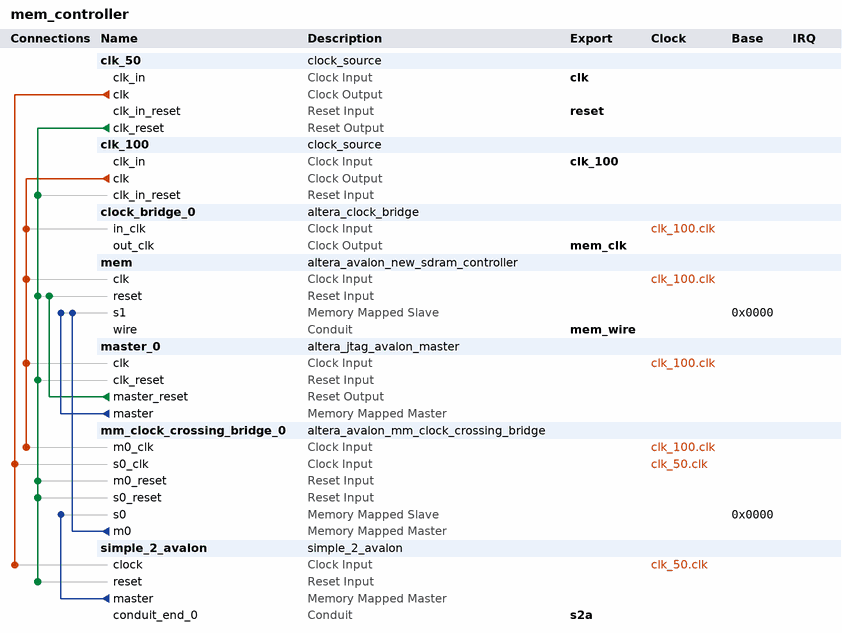
[diagram p0: system contents]
# Platform Designer (Qsys) system mem_controller, Cyclone IV E EP4CE6E22C8
# Parameters at their usual value, and those the tool derives, are not listed.
package require -exact qsys 14.0
create_system mem_controller
set_project_property DEVICE_FAMILY {Cyclone IV E}
set_project_property DEVICE EP4CE6E22C8

add_instance clk_50 clock_source 14.0
set_instance_parameter_value clk_50 clockFrequency 50000000

add_instance clk_100 clock_source 14.0
set_instance_parameter_value clk_100 clockFrequency 100000000

add_instance clock_bridge_0 altera_clock_bridge 14.0
set_instance_parameter_value clock_bridge_0 DERIVED_CLOCK_RATE 100000000
set_instance_parameter_value clock_bridge_0 EXPLICIT_CLOCK_RATE 0

add_instance mem altera_avalon_new_sdram_controller 14.0
set_instance_parameter_value mem TAC 5.5
set_instance_parameter_value mem TRCD 15.0
set_instance_parameter_value mem TRP 20.0
set_instance_parameter_value mem TWR 7.0
set_instance_parameter_value mem casLatency 3
set_instance_parameter_value mem columnWidth 8
set_instance_parameter_value mem dataWidth 16
set_instance_parameter_value mem generateSimulationModel true
set_instance_parameter_value mem model single_Micron_MT48LC4M32B2_7_chip
set_instance_parameter_value mem numberOfBanks 2
set_instance_parameter_value mem numberOfChipSelects 1
set_instance_parameter_value mem powerUpDelay 200.0
set_instance_parameter_value mem refreshPeriod 15.625
set_instance_parameter_value mem rowWidth 11

add_instance master_0 altera_jtag_avalon_master 14.0

add_instance mm_clock_crossing_bridge_0 altera_avalon_mm_clock_crossing_bridge 14.0
set_instance_parameter_value mm_clock_crossing_bridge_0 DATA_WIDTH 32
set_instance_parameter_value mm_clock_crossing_bridge_0 ADDRESS_WIDTH 19
set_instance_parameter_value mm_clock_crossing_bridge_0 USE_AUTO_ADDRESS_WIDTH 0
set_instance_parameter_value mm_clock_crossing_bridge_0 ADDRESS_UNITS WORDS
set_instance_parameter_value mm_clock_crossing_bridge_0 MAX_BURST_SIZE 1
set_instance_parameter_value mm_clock_crossing_bridge_0 COMMAND_FIFO_DEPTH 4
set_instance_parameter_value mm_clock_crossing_bridge_0 RESPONSE_FIFO_DEPTH 4
set_instance_parameter_value mm_clock_crossing_bridge_0 MASTER_SYNC_DEPTH 2
set_instance_parameter_value mm_clock_crossing_bridge_0 SLAVE_SYNC_DEPTH 2

add_instance simple_2_avalon simple_2_avalon 1.0
set_instance_parameter_value simple_2_avalon ADDR_W 21

# connections
add_connection clk_50.clk mm_clock_crossing_bridge_0.s0_clk clock
add_connection clk_50.clk simple_2_avalon.clock clock
add_connection clk_100.clk clock_bridge_0.in_clk clock
add_connection clk_100.clk master_0.clk clock
add_connection clk_100.clk mem.clk clock
add_connection clk_100.clk mm_clock_crossing_bridge_0.m0_clk clock
add_connection clk_50.clk_reset clk_100.clk_in_reset reset
add_connection clk_50.clk_reset master_0.clk_reset reset
add_connection clk_50.clk_reset mem.reset reset
add_connection clk_50.clk_reset mm_clock_crossing_bridge_0.m0_reset reset
add_connection clk_50.clk_reset mm_clock_crossing_bridge_0.s0_reset reset
add_connection clk_50.clk_reset simple_2_avalon.reset reset
add_connection master_0.master_reset mem.reset reset
add_connection master_0.master mem.s1 avalon
set_connection_parameter_value master_0.master/mem.s1 baseAddress 0x0000
add_connection mm_clock_crossing_bridge_0.m0 mem.s1 avalon
set_connection_parameter_value mm_clock_crossing_bridge_0.m0/mem.s1 baseAddress 0x0000
add_connection simple_2_avalon.master mm_clock_crossing_bridge_0.s0 avalon
set_connection_parameter_value simple_2_avalon.master/mm_clock_crossing_bridge_0.s0 baseAddress 0x0000

# exported interfaces
add_interface clk clock sink
set_interface_property clk EXPORT_OF clk_50.clk_in
add_interface reset reset sink
set_interface_property reset EXPORT_OF clk_50.clk_in_reset
add_interface mem_wire conduit end
set_interface_property mem_wire EXPORT_OF mem.wire
add_interface mem_clk clock source
set_interface_property mem_clk EXPORT_OF clock_bridge_0.out_clk
add_interface s2a conduit end
set_interface_property s2a EXPORT_OF simple_2_avalon.conduit_end_0
add_interface clk_100 clock sink
set_interface_property clk_100 EXPORT_OF clk_100.clk_in

set_interconnect_requirement {$system} qsys_mm.clockCrossingAdapter HANDSHAKE
set_interconnect_requirement {$system} qsys_mm.maxAdditionalLatency 1
set_interconnect_requirement {$system} qsys_mm.insertDefaultSlave FALSE

save_system mem_controller.qsys
